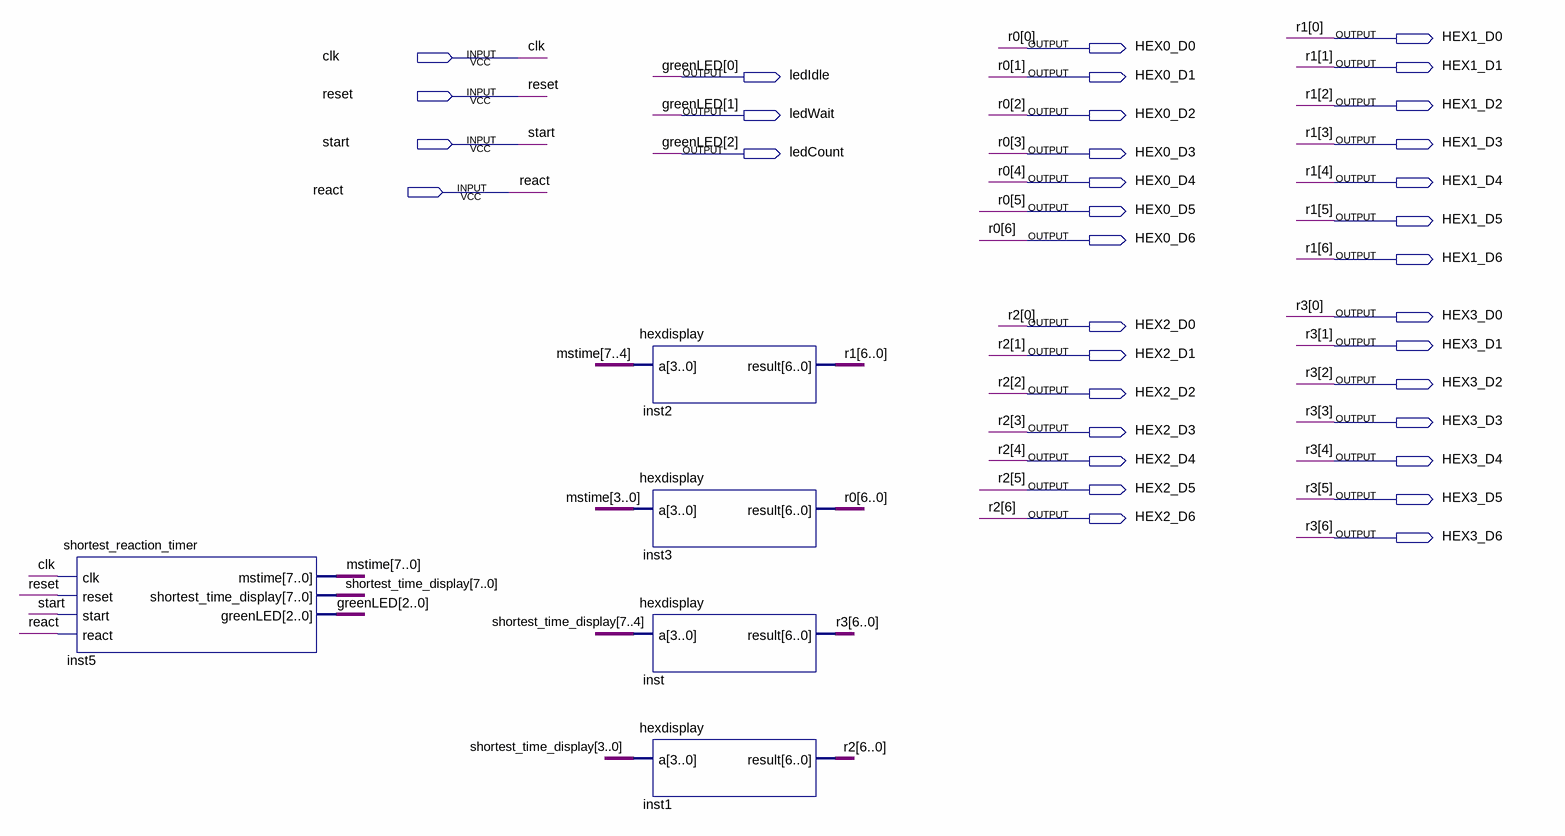
[diagram p0: schematic sheet]
// Quartus schematic shortest_reaction_time.bdf as structural Verilog: 5 symbols, 35 pins
module shortest_reaction_time (
  input  clk,
  input  reset,
  input  start,
  input  react,
  output HEX1_D0,
  output HEX0_D0,
  output HEX1_D1,
  output ledIdle,
  output HEX0_D1,
  output HEX1_D2,
  output ledWait,
  output HEX0_D2,
  output HEX1_D3,
  output ledCount,
  output HEX0_D3,
  output HEX0_D4,
  output HEX1_D4,
  output HEX0_D5,
  output HEX1_D5,
  output HEX0_D6,
  output HEX1_D6,
  output HEX3_D0,
  output HEX2_D0,
  output HEX3_D1,
  output HEX2_D1,
  output HEX3_D2,
  output HEX2_D2,
  output HEX3_D3,
  output HEX2_D3,
  output HEX2_D4,
  output HEX3_D4,
  output HEX2_D5,
  output HEX3_D5,
  output HEX2_D6,
  output HEX3_D6
);

  wire [7:0] mstime, shortest_time_display;

  shortest_reaction_timer inst5 (
    .clk(clk), .reset(reset), .start(start), .react(react), .mstime(mstime),
    .shortest_time_display(shortest_time_display), .greenLED({ledCount, ledWait, ledIdle}));
  hexdisplay inst2 (.a(mstime[7:4]), .result({HEX1_D6, HEX1_D5, HEX1_D4, HEX1_D3, HEX1_D2, HEX1_D1, HEX1_D0}));
  hexdisplay inst3 (.a(mstime[3:0]), .result({HEX0_D6, HEX0_D5, HEX0_D4, HEX0_D3, HEX0_D2, HEX0_D1, HEX0_D0}));
  hexdisplay inst (
    .a(shortest_time_display[7:4]), .result({HEX3_D6, HEX3_D5, HEX3_D4, HEX3_D3, HEX3_D2, HEX3_D1, HEX3_D0}));
  hexdisplay inst1 (
    .a(shortest_time_display[3:0]), .result({HEX2_D6, HEX2_D5, HEX2_D4, HEX2_D3, HEX2_D2, HEX2_D1, HEX2_D0}));

  // Other names for the same wires on the sheet: greenLED[2:0] = {ledCount, ledWait, ledIdle};
  //   r0[6:0] = {HEX0_D6, HEX0_D5, HEX0_D4, HEX0_D3, HEX0_D2, HEX0_D1, HEX0_D0};
  //   r1[6:0] = {HEX1_D6, HEX1_D5, HEX1_D4, HEX1_D3, HEX1_D2, HEX1_D1, HEX1_D0};
  //   r2[6:0] = {HEX2_D6, HEX2_D5, HEX2_D4, HEX2_D3, HEX2_D2, HEX2_D1, HEX2_D0};
  //   r3[6:0] = {HEX3_D6, HEX3_D5, HEX3_D4, HEX3_D3, HEX3_D2, HEX3_D1, HEX3_D0}
endmodule
